# Altium schematic sheet 15.SchDoc
size 513 x 386 mm
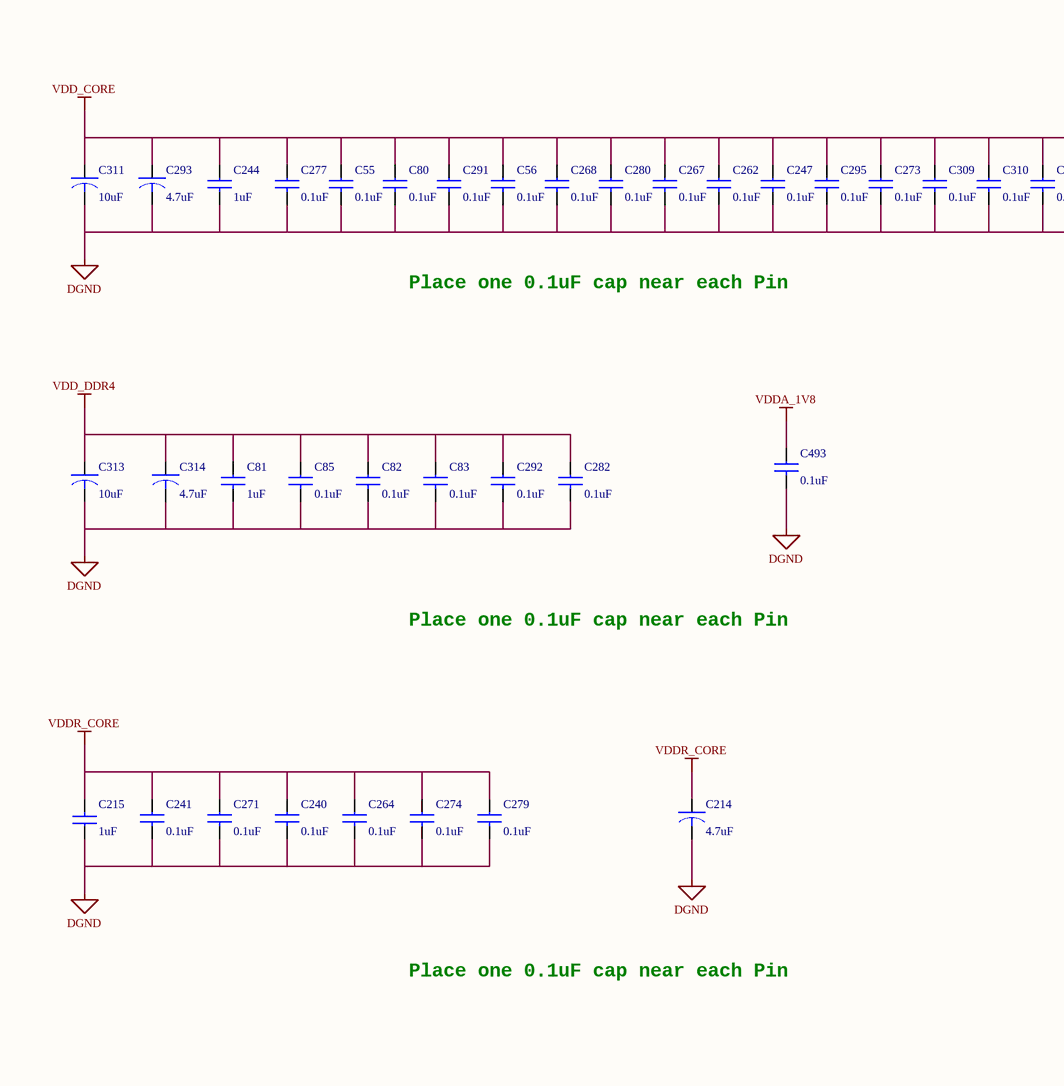
[diagram p0: 15.SchDoc, left]
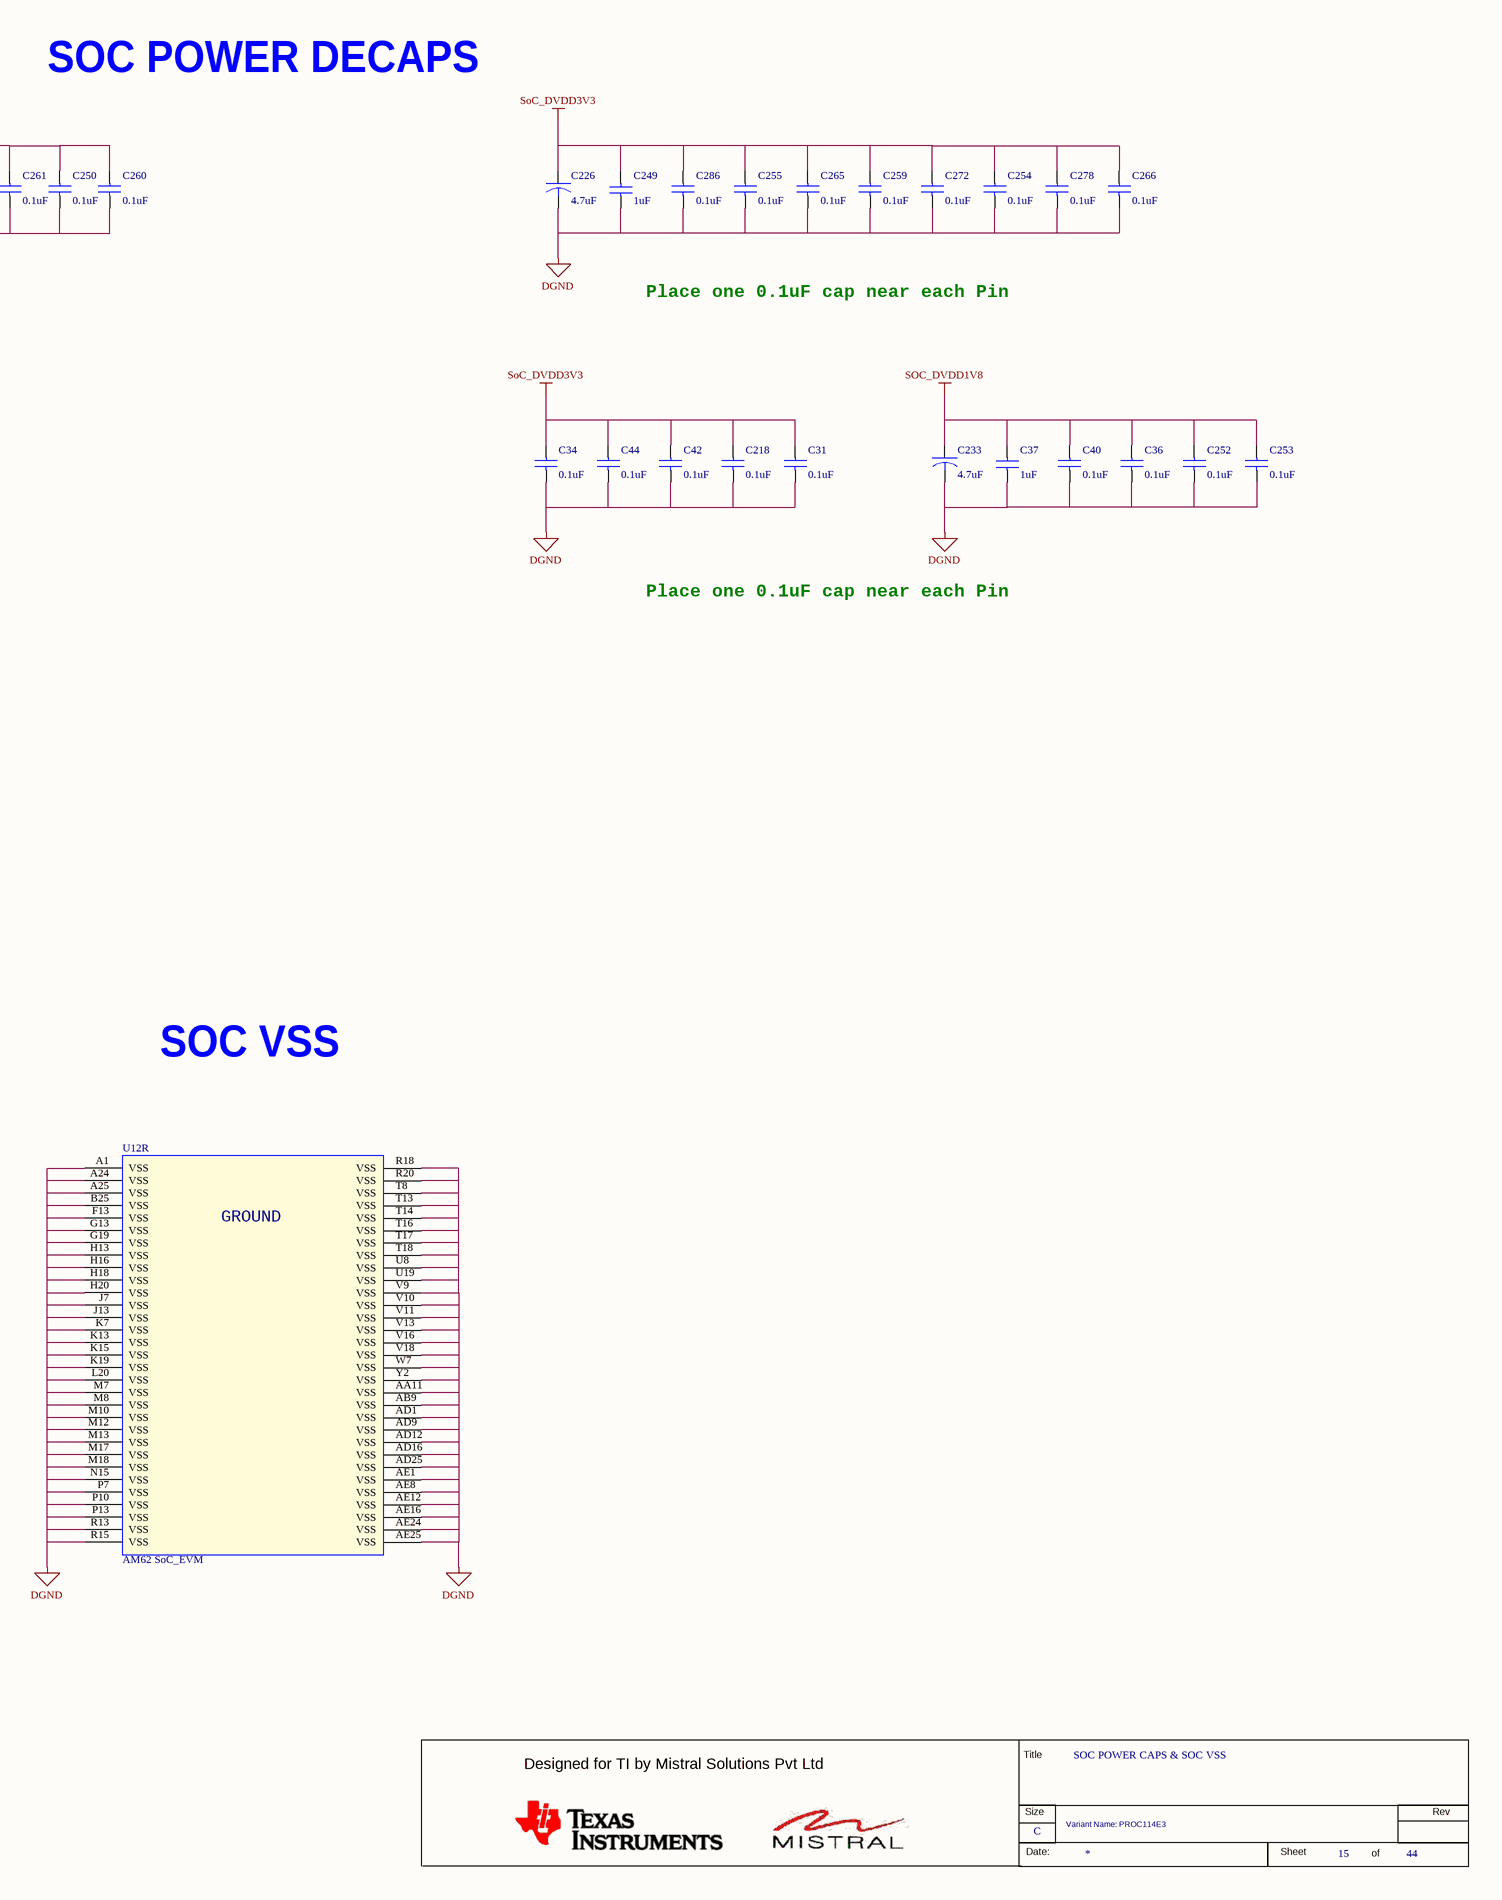
[diagram p1: 15.SchDoc, right]

## Parts
*  Title: SOC POWER CAPS & SOC VSS  Page Size: C  Page Number: 15  Page Count: 44  Variant Name: PROC114E3  (hidden comment: MISTRAL_TITLEBLK_CSIZE)  (graphical)
C31  0.1uF  [CAP0201_0-5]
C34  0.1uF  [CAP0201_0-5]
C36  0.1uF  [CAP0201_0-5]
C37  1uF  [CAP0201_0-5]
C40  0.1uF  [CAP0201_0-5]
C42  0.1uF  [CAP0201_0-5]
C44  0.1uF  [CAP0201_0-5]
C55  0.1uF  [CAP0201_0-5]
C56  0.1uF  [CAP0201_0-5]
C80  0.1uF  [CAP0201_0-5]
C81  1uF  [CAP0201_0-5]
C82  0.1uF  [CAP0201_0-5]
C83  0.1uF  [CAP0201_0-5]
C85  0.1uF  [CAP0201_0-5]
C214  4.7uF  [CAP0402_0-75]
C215  1uF  [CAP0201_0-5]
C218  0.1uF  [CAP0201_0-5]
C226  4.7uF  [CAP0402_0-75]
C233  4.7uF  [CAP0402_0-75]
C240  0.1uF  [CAP0201_0-5]
C241  0.1uF  [CAP0201_0-5]
C244  1uF  [CAP0201_0-5]
C247  0.1uF  [CAP0201_0-5]
C249  1uF  [CAP0201_0-5]
C250  0.1uF  [CAP0201_0-5]
C252  0.1uF  [CAP0201_0-5]
C253  0.1uF  [CAP0201_0-5]
C254  0.1uF  [CAP0201_0-5]
C255  0.1uF  [CAP0201_0-5]
C259  0.1uF  [CAP0201_0-5]
C260  0.1uF  [CAP0201_0-5]
C261  0.1uF  [CAP0201_0-5]
C262  0.1uF  [CAP0201_0-5]
C264  0.1uF  [CAP0201_0-5]
C265  0.1uF  [CAP0201_0-5]
C266  0.1uF  [CAP0201_0-5]
C267  0.1uF  [CAP0201_0-5]
C268  0.1uF  [CAP0201_0-5]
C271  0.1uF  [CAP0201_0-5]
C272  0.1uF  [CAP0201_0-5]
C273  0.1uF  [CAP0201_0-5]
C274  0.1uF  [CAP0201_0-5]
C277  0.1uF  [CAP0201_0-5]
C278  0.1uF  [CAP0201_0-5]
C279  0.1uF  [CAP0201_0-5]
C280  0.1uF  [CAP0201_0-5]
C282  0.1uF  [CAP0201_0-5]
C286  0.1uF  [CAP0201_0-5]
C291  0.1uF  [CAP0201_0-5]
C292  0.1uF  [CAP0201_0-5]
C293  4.7uF  [CAP0402_0-75]
C295  0.1uF  [CAP0201_0-5]
C309  0.1uF  [CAP0201_0-5]
C310  0.1uF  [CAP0201_0-5]
C311  10uF  [CAP0402_0-75]
C313  10uF  [CAP0402_0-75]
C314  4.7uF  [CAP0402_0-75]
C493  0.1uF  [CAP0201_0-5]
U12  AM62 SoC_EVM  [BGA425_19-68_510X510_0-7]  (part R of 18)

## Nets
DGND: C31.2 C34.2 C36.2 C37.1 C40.2 C42.2 C44.2 C55.2 C56.2 C80.2 C81.2 C82.2 C83.2 C85.2 C214.2 C215.1 C218.2 C226.2 C233.2 C240.2 C241.2 C244.2 C247.2 C249.1 C250.2 C252.2 C253.2 C254.2 C255.2 C259.2 C260.2 C261.2 C262.2 C264.2 C265.2 C266.2 C267.2 C268.2 C271.2 C272.2 C273.2 C274.2 C277.2 C278.2 C279.2 C280.2 C282.2 C286.2 C291.2 C292.2 C293.2 C295.2 C309.2 C310.2 C311.2 C313.2 C314.2 C493.2 U12.A1(VSS) U12.A24(VSS) U12.A25(VSS) U12.AA11(VSS) U12.AB9(VSS) U12.AD1(VSS) U12.AD9(VSS) U12.AD12(VSS) U12.AD16(VSS) U12.AD25(VSS) U12.AE1(VSS) U12.AE8(VSS) U12.AE12(VSS) U12.AE16(VSS) U12.AE24(VSS) U12.AE25(VSS) U12.B25(VSS) U12.F13(VSS) U12.G13(VSS) U12.G19(VSS) U12.H13(VSS) U12.H16(VSS) U12.H18(VSS) U12.H20(VSS) U12.J7(VSS) U12.J13(VSS) U12.K7(VSS) U12.K13(VSS) U12.K15(VSS) U12.K19(VSS) U12.L20(VSS) U12.M7(VSS) U12.M8(VSS) U12.M10(VSS) U12.M12(VSS) U12.M13(VSS) U12.M17(VSS) U12.M18(VSS) U12.N15(VSS) U12.P7(VSS) U12.P10(VSS) U12.P13(VSS) U12.R13(VSS) U12.R15(VSS) U12.R18(VSS) U12.R20(VSS) U12.T8(VSS) U12.T13(VSS) U12.T14(VSS) U12.T16(VSS) U12.T17(VSS) U12.T18(VSS) U12.U8(VSS) U12.U19(VSS) U12.V9(VSS) U12.V10(VSS) U12.V11(VSS) U12.V13(VSS) U12.V16(VSS) U12.V18(VSS) U12.W7(VSS) U12.Y2(VSS)
SOC_DVDD1V8: C36.1 C37.2 C40.1 C233.1 C252.1 C253.1
SoC_DVDD3V3: C31.1 C34.1 C42.1 C44.1 C218.1 C226.1 C249.2 C254.1 C255.1 C259.1 C265.1 C266.1 C272.1 C278.1 C286.1
VDD_CORE: C55.1 C56.1 C80.1 C244.1 C247.1 C250.1 C260.1 C261.1 C262.1 C267.1 C268.1 C273.1 C277.1 C280.1 C291.1 C293.1 C295.1 C309.1 C310.1 C311.1
VDD_DDR4: C81.1 C82.1 C83.1 C85.1 C282.1 C292.1 C313.1 C314.1
VDDA_1V8: C493.1
VDDR_CORE: C214.1 C215.2 C240.1 C241.1 C264.1 C271.1 C274.1 C279.1

## Notes on the sheet
- SOC POWER DECAPS
- Place one 0.1uF cap near each Pin
- SOC VSS
- (in symbol AM62-EVM_BGA425, part R) GROUND
- (in symbol MISTRAL_TITLEBLK_CSIZE) Title; Designed for TI by Mistral Solutions Pvt Ltd; Size; Rev; Date:; Sheet; of

## Library data of the parts
* = MISTRAL_TITLEBLK_CSIZE: RevCode: E3; Issue: 1.0; Page Create Date: March  8, 1995; Page Modify Date: *; Schematic Page Count: 44; Schematic Page Number: 15
C31 C36 C44 C55 C56 C80 C83 C218 C247 C253-C255 C262 C265 C266 C277 C279 C280 C282 C291 C295 C493 = CAP_Dup2: CAP CERAMIC 0.1uF 16V 10% X5R 0201; Part_type: CAPACITORS\CERAMIC; Mfr_part_number: GRM033R61C104KE14D; Mfr_name: MURATA; Mistral Part No: 120009030072-R; Custom_Duty: 15%; Customs_HS_Code: 85322990; Wattage: NA; Project: TI_MAXIE_CPB; PCB Footprint: CAP0201_0-5; Footprint Path: Y:\MIS_DATABASE\Library\ALTIUM_TOOL\PCB_FOOTPRINTS\Altium_Footprint_Lib.PcbLib; Library Path: Y:\MIS_DATABASE\Library\ALTIUM_TOOL\SCHEMATICS_PARTS\MS_DISCRETE_Library.schlib; Footprint Ref: CAP0201_0-5; MECHANICAL 3D STEP FILE: CAP0201_0-5; Chkd/date: MANIRAJA/230118; Crtd /date: MANIRAJA/230118; Datasheet: Y:\MIS_DATABASE\DATASHEETS\CAPACITORS\GRM033R61C104KE14.PDF; Temperature: -55°C+85°C; Weight: 0.33mg; Height: 0.33MM; Distributor_part_number: 490-14305-1-ND; Distributor_name: DIGIKEY; Package: 0201; Voltage: 16V; Tolerance: 10%; Library Ref: CAP
C34 C40 C42 C82 C85 C240 C241 C250 C252 C259-C261 C264 C267 C268 C271-C274 C278 C286 C292 C309 C310 = CAP_Dup2: CAP CERAMIC 0.1uF 16V 10% X5R 0201; Mistral Part No: 120009030072-R; Mfr_name: MURATA; Mfr_part_number: GRM033R61C104KE14D; Part_type: CAPACITORS\CERAMIC; Project: TI_MAXIE_CPB; Wattage: NA; Customs_HS_Code: 85322990; Custom_Duty: 15%; PCB Footprint: CAP0201_0-5; Library Ref: CAP; Tolerance: 10%; Voltage: 16V; Package: 0201; Distributor_name: DIGIKEY; Distributor_part_number: 490-14305-1-ND; Height: 0.33MM; Weight: 0.33mg; Temperature: -55°C+85°C; Datasheet: Y:\MIS_DATABASE\DATASHEETS\CAPACITORS\GRM033R61C104KE14.PDF; Crtd /date: MANIRAJA/230118; Chkd/date: MANIRAJA/230118; MECHANICAL 3D STEP FILE: CAP0201_0-5; Footprint Ref: CAP0201_0-5; Library Path: Y:\MIS_DATABASE\Library\ALTIUM_TOOL\SCHEMATICS_PARTS\MS_DISCRETE_Library.schlib; Footprint Path: Y:\MIS_DATABASE\Library\ALTIUM_TOOL\PCB_FOOTPRINTS\Altium_Footprint_Lib.PcbLib
C37 C215 C244 = CAP_Dup2: CAP CERAMIC 1uF 16V 20% X5R 0201; Mistral Part No: 120018090038-R; Mfr_name: MURATA; Mfr_part_number: GRM033R61C105ME15D; Part_type: CAPACITORS\CERAMIC; Project: QCS610_NANOSOM; Wattage: NA; Customs_HS_Code: 85322990; Custom_Duty: 15%; PCB Footprint: CAP0201_0-5; Footprint Path: Y:\MIS_DATABASE\Library\ALTIUM_TOOL\PCB_FOOTPRINTS\Altium_Footprint_Lib.PcbLib; Library Path: Y:\MIS_DATABASE\Library\ALTIUM_TOOL\SCHEMATICS_PARTS\MS_DISCRETE_Library.schlib; MECHANICAL 3D STEP FILE: CAP0201_0-5; Tolerance: 20%; Voltage: 16V; Package: 0201; Distributor_name: DIGIKEY; Distributor_part_number: 490-18654-1-ND; Height: 0.39MM; Weight: 0.33mg; Temperature: -55°C+85°C; Datasheet: Y:\MIS_DATABASE\DATASHEETS\CAPACITORS\GRM033R61C105ME15.PDF; Crtd /date: ALVY/260520; Chkd/date: MANIRAJA/300520; Library Ref: CAP; Footprint Ref: CAP0201_0-5
C81 C249 = CAP_Dup2: CAP CERAMIC 1uF 16V 20% X5R 0201; Part_type: CAPACITORS\CERAMIC; Mfr_part_number: GRM033R61C105ME15D; Mfr_name: MURATA; Mistral Part No: 120018090038-R; Custom_Duty: 15%; Customs_HS_Code: 85322990; Wattage: NA; Project: QCS610_NANOSOM; PCB Footprint: CAP0201_0-5; Footprint Ref: CAP0201_0-5; Library Ref: CAP; Chkd/date: MANIRAJA/300520; Crtd /date: ALVY/260520; Datasheet: Y:\MIS_DATABASE\DATASHEETS\CAPACITORS\GRM033R61C105ME15.PDF; Temperature: -55°C+85°C; Weight: 0.33mg; Height: 0.39MM; Distributor_part_number: 490-18654-1-ND; Distributor_name: DIGIKEY; Package: 0201; Voltage: 16V; Tolerance: 20%; MECHANICAL 3D STEP FILE: CAP0201_0-5; Library Path: Y:\MIS_DATABASE\Library\ALTIUM_TOOL\SCHEMATICS_PARTS\MS_DISCRETE_Library.schlib; Footprint Path: Y:\MIS_DATABASE\Library\ALTIUM_TOOL\PCB_FOOTPRINTS\Altium_Footprint_Lib.PcbLib
C214 C293 C314 = CAP_Dup1: CAP CERAMIC 4.7uF 10V 20% X5R 0402; Mistral Part No: 120012060002-R; Mfr_name: MURATA; Mfr_part_number: GRM155R61A475MEAAD; Part_type: CAPACITORS\CERAMIC; Project: TI_J7SVB_PCIE_ADD-ON-CARD; Wattage: NA; Customs_HS_Code: 85322990; Custom_Duty: 15%; PCB Footprint: CAP0402_0-75; Footprint Ref: CAP0402_0-75; Tolerance: 20%; Voltage: 10V; Package: 0402; Distributor_name: DIGIKEY; Distributor_part_number: 490-14306-1-ND; Library Ref: CAP; Height: 0.65MM; Weight: 14mg; Temperature: -55°C+85°C; Datasheet: Y:\MIS_DATABASE\DATASHEETS\CAPACITORS\GRM155R61A475MEAAD.PDF; Crtd /date: ALVY/110718; Chkd/date: MANIRAJA/110718; MECHANICAL 3D STEP FILE: CAP0402_0-75; Library Path: Y:\MIS_DATABASE\Library\ALTIUM_TOOL\SCHEMATICS_PARTS\MS_DISCRETE_Library.schlib; Footprint Path: Y:\MIS_DATABASE\Library\ALTIUM_TOOL\PCB_FOOTPRINTS\Altium_Footprint_Lib.PcbLib
C226 C233 = CAP_Dup1: CAP CERAMIC 4.7uF 10V 20% X5R 0402; Part_type: CAPACITORS\CERAMIC; Mfr_part_number: GRM155R61A475MEAAD; Mfr_name: MURATA; Mistral Part No: 120012060002-R; Custom_Duty: 15%; Customs_HS_Code: 85322990; Wattage: NA; Project: TI_J7SVB_PCIE_ADD-ON-CARD; PCB Footprint: CAP0402_0-75; Footprint Path: Y:\MIS_DATABASE\Library\ALTIUM_TOOL\PCB_FOOTPRINTS\Altium_Footprint_Lib.PcbLib; Library Path: Y:\MIS_DATABASE\Library\ALTIUM_TOOL\SCHEMATICS_PARTS\MS_DISCRETE_Library.schlib; MECHANICAL 3D STEP FILE: CAP0402_0-75; Chkd/date: MANIRAJA/110718; Crtd /date: ALVY/110718; Datasheet: Y:\MIS_DATABASE\DATASHEETS\CAPACITORS\GRM155R61A475MEAAD.PDF; Temperature: -55°C+85°C; Weight: 14mg; Height: 0.65MM; Library Ref: CAP; Distributor_part_number: 490-14306-1-ND; Distributor_name: DIGIKEY; Package: 0402; Voltage: 10V; Tolerance: 20%; Footprint Ref: CAP0402_0-75
C311 = CAP_Dup1: CAP CERAMIC 10uF 10V 20% X5R 0402; Part_type: CAPACITORS\CERAMIC; Mfr_part_number: GRM155R61A106ME11D; Mfr_name: MURATA; Mistral Part No: 120013110019-R; Custom_Duty: 15%; Customs_HS_Code: 85322990; Wattage: NA; Project: QCS610_NANOSOM; PCB Footprint: CAP0402_0-75; Footprint Path: Y:\MIS_DATABASE\Library\ALTIUM_TOOL\PCB_FOOTPRINTS\Altium_Footprint_Lib.PcbLib; Library Path: Y:\MIS_DATABASE\Library\ALTIUM_TOOL\SCHEMATICS_PARTS\MS_DISCRETE_Library.schlib; MECHANICAL 3D STEP FILE: CAP0402_0-75; Chkd/date: MANIRAJA/300520; Crtd /date: ALVY/260520; Datasheet: Y:\MIS_DATABASE\DATASHEETS\CAPACITORS\MURATA-GXX-SER_NOV17.PDF; Temperature: -55°C+85°C; Weight: 3.1mg; Height: 0.55MM; Library Ref: CAP; Distributor_part_number: 490-GRM155R61A106ME11DTR-ND; Distributor_name: DIGIKEY; Package: 0402; Voltage: 10V; Tolerance: 20%; Footprint Ref: CAP0402_0-75
C313 = CAP_Dup1: CAP CERAMIC 10uF 10V 20% X5R 0402; Mistral Part No: 120013110019-R; Mfr_name: MURATA; Mfr_part_number: GRM155R61A106ME11D; Part_type: CAPACITORS\CERAMIC; Project: QCS610_NANOSOM; Wattage: NA; Customs_HS_Code: 85322990; Custom_Duty: 15%; PCB Footprint: CAP0402_0-75; Footprint Ref: CAP0402_0-75; Tolerance: 20%; Voltage: 10V; Package: 0402; Distributor_name: DIGIKEY; Distributor_part_number: 490-GRM155R61A106ME11DTR-ND; Library Ref: CAP; Height: 0.55MM; Weight: 3.1mg; Temperature: -55°C+85°C; Datasheet: Y:\MIS_DATABASE\DATASHEETS\CAPACITORS\MURATA-GXX-SER_NOV17.PDF; Crtd /date: ALVY/260520; Chkd/date: MANIRAJA/300520; MECHANICAL 3D STEP FILE: CAP0402_0-75; Library Path: Y:\MIS_DATABASE\Library\ALTIUM_TOOL\SCHEMATICS_PARTS\MS_DISCRETE_Library.schlib; Footprint Path: Y:\MIS_DATABASE\Library\ALTIUM_TOOL\PCB_FOOTPRINTS\Altium_Footprint_Lib.PcbLib
U12 = AM62-EVM_BGA425: IC AM62 SoC MICROPROCESSOR BGA425; Part_type: ICS\DIGITAL\MICROPROCESSOR; Mfr_name: TEXAS INSTRUMENTS; Mistral Part No: 141221060001; Custom_Duty: 15%; Customs_HS_Code: 85423100; Wattage: NA; Project: AM62_EVM_BRD; PCB Footprint: BGA425_19-68_510X510_0-7; Footprint Path: Y:\MIS_DATABASE\Library\ALTIUM_TOOL\PCB_FOOTPRINTS\Altium_Footprint_Lib.PcbLib; Library Path: Y:\MIS_DATABASE\Library\ALTIUM_TOOL\SCHEMATICS_PARTS\MS_MICROPROCESSOR_Library.schlib; MECHANICAL 3D STEP FILE: BGA425_19-68_510X510_0-7; RoHS: NA; Chkd/date: ALVY/110621; Crtd /date: MANIRAJA/110621; Datasheet: Y:\MIS_DATABASE\DATASHEETS\ICS\DIGITAL\MICROCONTROLLER\AM62-SoC_SVB.PDF; Temperature: NA; Weight: NA; Height: 0.65MM; Footprint Ref: BGA425_19-68_510X510_0-7; Library Ref: AM62-EVM_BGA425; Distributor_part_number: NA; Distributor_name: NA; Package: BGA425; Voltage: NA; Tolerance: NA; Mfr_part_number: AM62 SoC_EVM